# Altium schematic sheet HEXADECASPI_PSRAM.SchDoc: HEXADECASPI PSRAM
size A4; Date: Not used; ApprovedBy: Not used; CheckedBy: Not used; Author: Not used; CompanyName: STMicroelectronics; DrawnBy: Not used; Engineer: Not used; Organization: Not used; Address1: Not used; Address2: Not used; Address3: Not used; Address4: Not used; DocumentNumber: Not used; Revision: Not used; SheetNumber: 7; SheetTotal: 16; CurrentTime: Not used; CurrentDate: Not used; Time: Not used; DocumentFullPathAndName: Not used; DocumentName: Not used; ModifiedDate: Not used; ImagePath: Not used; ProjectName: Not used; Application_BuildNumber: Not used
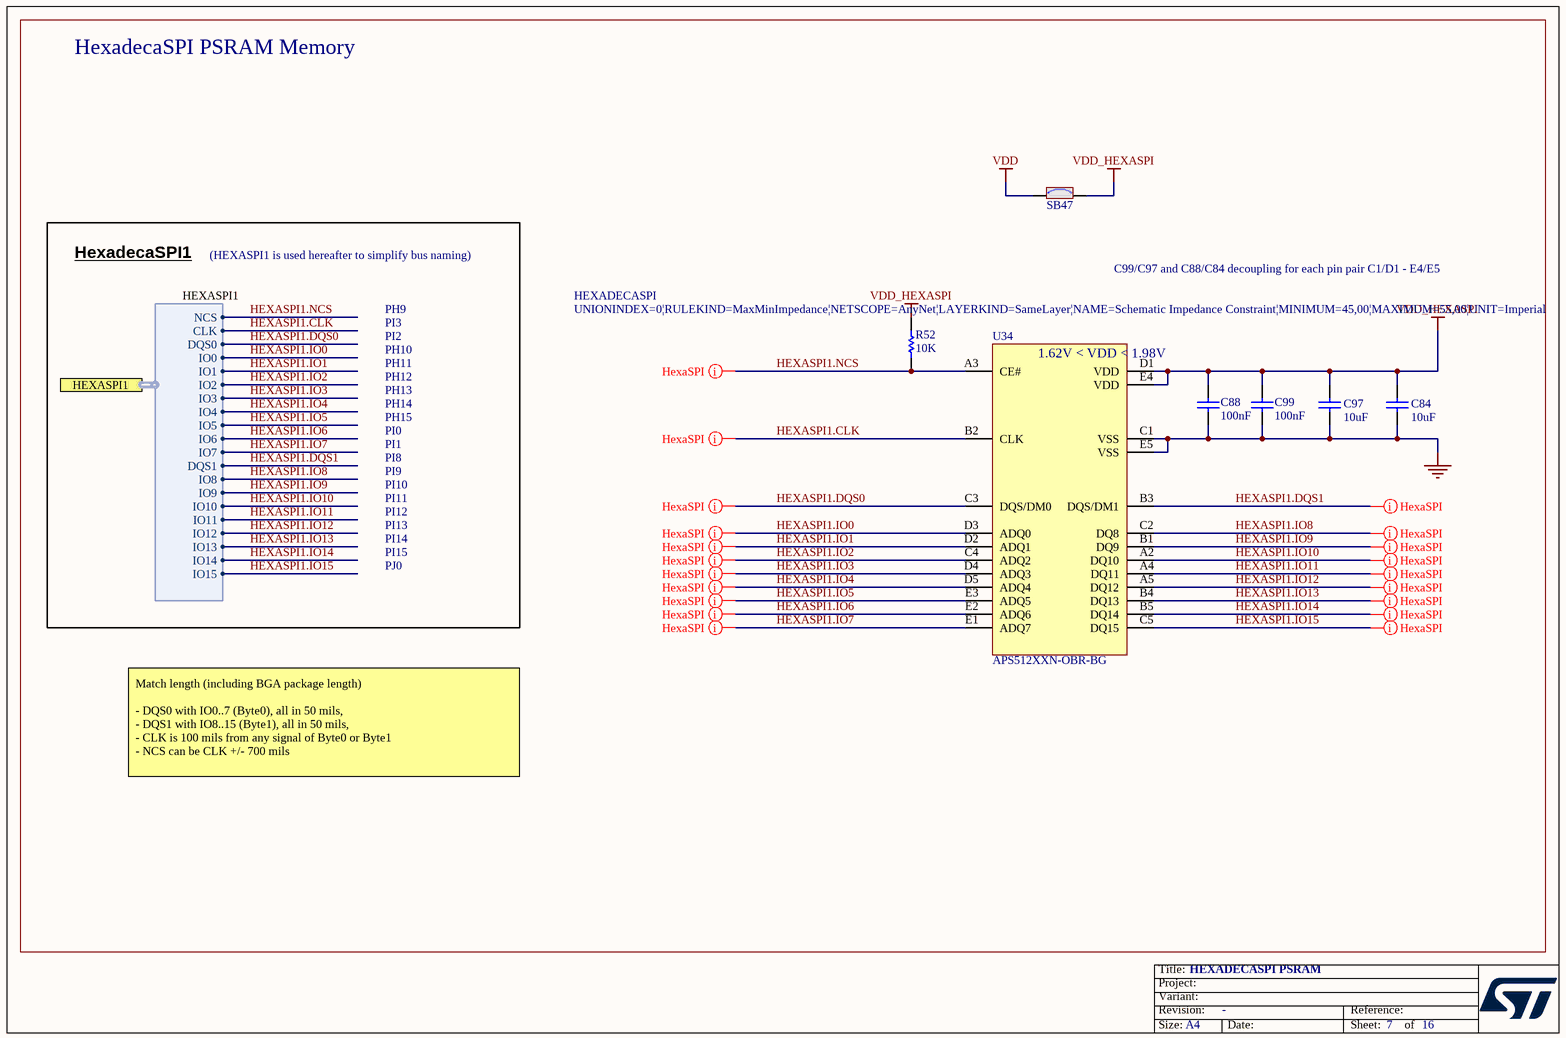
[diagram p0: HEXADECASPI_PSRAM.SchDoc]

## Parts
C84  value 10uF  [C0603_H0P8]  (hidden comment: Capacitor)
C88  value 100nF  [C0402]  (hidden comment: Capacitor)
C97  value 10uF  [C0603_H0P8]  (hidden comment: Capacitor)
C99  value 100nF  [C0402]  (hidden comment: Capacitor)
R52  value 10K  [R0402]  (hidden comment: Resistor)
SB47  SB_ON  [SOLDER-BRIDGE_R0402-0R]  (value not drawn)
U34  value APS512XXN-OBR-BG  [ICC_BGA24_5X5-BALL-ARRAY_6X8_P1]  (hidden comment: APS256XXN-OBR-BG)

## Ports
HEXASPI1 (harness HEXASPI1)

## Harnesses
HEXASPI1: IO1, IO0, DQS0, NCS, IO2, IO3, IO5, IO4, IO6, IO7, CLK, DQS1, IO8, IO9, IO10, IO11, IO12, IO13, IO14, IO15

## Nets
GND: C84.1 C88.1 C97.1 C99.1 U34.C1(VSS) U34.E5(VSS)
VDD: SB47.1
VDD_HEXASPI: C84.2 C88.2 C97.2 C99.2 R52.2 SB47.2 U34.D1(VDD) U34.E4(VDD)
HEXASPI1.CLK: U34.B2(CLK) ; port HEXASPI1.CLK
HEXASPI1.DQS0: U34.C3(DQS/DM0) ; port HEXASPI1.DQS0
HEXASPI1.DQS1: U34.B3(DQS/DM1) ; port HEXASPI1.DQS1
HEXASPI1.IO0: U34.D3(ADQ0) ; port HEXASPI1.IO0
HEXASPI1.IO1: U34.D2(ADQ1) ; port HEXASPI1.IO1
HEXASPI1.IO2: U34.C4(ADQ2) ; port HEXASPI1.IO2
HEXASPI1.IO3: U34.D4(ADQ3) ; port HEXASPI1.IO3
HEXASPI1.IO4: U34.D5(ADQ4) ; port HEXASPI1.IO4
HEXASPI1.IO5: U34.E3(ADQ5) ; port HEXASPI1.IO5
HEXASPI1.IO6: U34.E2(ADQ6) ; port HEXASPI1.IO6
HEXASPI1.IO7: U34.E1(ADQ7) ; port HEXASPI1.IO7
HEXASPI1.IO8: U34.C2(DQ8) ; port HEXASPI1.IO8
HEXASPI1.IO9: U34.B1(DQ9) ; port HEXASPI1.IO9
HEXASPI1.IO10: U34.A2(DQ10) ; port HEXASPI1.IO10
HEXASPI1.IO11: U34.A4(DQ11) ; port HEXASPI1.IO11
HEXASPI1.IO12: U34.A5(DQ12) ; port HEXASPI1.IO12
HEXASPI1.IO13: U34.B4(DQ13) ; port HEXASPI1.IO13
HEXASPI1.IO14: U34.B5(DQ14) ; port HEXASPI1.IO14
HEXASPI1.IO15: U34.C5(DQ15) ; port HEXASPI1.IO15
HEXASPI1.NCS: R52.1 U34.A3(CE#) ; port HEXASPI1.NCS

## Layout directives
rule Matched Net Lengths [Tolerance = 1000mil]; net class HEXASPI; rule Impedance Constraint [Min = 50.00    Max = 60.00    ]; rule Routing Layers [TopLayer - Enabled BottomLayer - Enabled ]: HEXASPI1.NCS
rule Matched Net Lengths [Tolerance = 20mil]; net class HEXASPI; rule Impedance Constraint [Min = 45.00    Max = 55.00    ]; rule Routing Layers [TopLayer - Enabled BottomLayer - Enabled ]: HEXASPI1.DQS1, HEXASPI1.IO0, HEXASPI1.IO1, HEXASPI1.IO2, HEXASPI1.IO3, HEXASPI1.IO4, HEXASPI1.IO5, HEXASPI1.IO6, HEXASPI1.IO7, HEXASPI1.IO8, HEXASPI1.IO9, HEXASPI1.IO10, HEXASPI1.IO11, HEXASPI1.IO12, HEXASPI1.IO13, HEXASPI1.IO14, HEXASPI1.IO15
rule Matched Net Lengths [Tolerance = 20mil]; net class HEXADECASPI; rule Impedance Constraint [Min = 45.00    Max = 55.00    ]; rule Routing Layers [TopLayer - Enabled BottomLayer - Enabled ]: HEXASPI1.CLK
rule Matched Net Lengths [Tolerance = 20mil]; net class HEXASPI; rule Impedance Constraint [Min = 50.00    Max = 60.00    ]; rule Routing Layers [TopLayer - Enabled BottomLayer - Enabled ]: HEXASPI1.DQS0

## Notes on the sheet
- HexadecaSPI PSRAM Memory
- HexadecaSPI1
- (HEXASPI1 is used hereafter to simplify bus naming)
- PH9
- C99/C97 and C88/C84 decoupling for each pin pair C1/D1 - E4/E5
- PH10
- PH11
- PH12
- PI2
- PI3
- 1.62V < VDD < 1.98V
- PH13
- PH14
- PH15
- PI0
- PI1
- PI8
- PI9
- PI10
- PI11
- PI12
- PI13
- PI14
- PI15
- PJ0
- Match length (including BGA package length)
  - DQS0 with IO0..7 (Byte0), all in 50 mils,
  - DQS1 with IO8..15 (Byte1), all in 50 mils,
  - CLK is 100 mils from any signal of Byte0 or Byte1
  - NCS can be CLK +/- 700 mils
- Title:
- Project:
- Size:
- Revision:
- Variant:
- A4
- -
- Date:
- Reference:
- Sheet:
- of

## Library data of the parts
C84 C97 = MCD-02605: Capacitor, MLCC, 10uF, 10V, X5R, +/-10%, 0603, T=0.8mm; Manufacturer_Part_Number: CC0603KRX5R6BB106; Manufacturer: YAGEO; Part_Preference: Recommended; Order_Code_RS: 2006536; ShowFields: YES; ID: 4711; Internal_Part_Number: MCD-02605; Status: Checked; Part_Type: Capacitor; Package: 0603; ComponentLink1URL: http://tunmcdsvn.tun.st.com/Component_Documentation_Library/Trunk/Capacitor/YAGEO_X5R_Series; Order_Code_Digikey: 311-1782-2-ND; Order_Code_Farnell: 3759761
C88 C99 = MCD-00006: Capacitor, MLCC, 100nF, 16V, X7R, +/-10%, 0402, T=0.5mm; Manufacturer_Part_Number: CC0402KRX7R7BB104; Manufacturer: YAGEO; Part_Preference: Recommended; Order_Code_RS: 616-9701; Component_Country_Of_Origin: China; Internal_Part_Number: MCD-00006; Status: Released; Part_Type: Capacitor; Package: 0402; ComponentLink1URL: http://tunmcdsvn.tun.st.com/Component_Documentation_Library/Trunk/Capacitor/YAGEO_X7R_Series; Order_Code_Digikey: 311-1338-1-ND; Order_Code_Farnell: 9402047
R52 = MCD-00053: Resistor, 10K, 0402, +/-1%, 1/16W; Manufacturer_Part_Number: RC0402FR-0710KL; Manufacturer: YAGEO; BMS_Part_Number: 9131590; Part_Preference: Recommended; Component_Country_Of_Origin: China; Internal_Part_Number: MCD-00053; Status: Released; Part_Type: Resistor; ComponentLink1URL: http://tunmcdsvn.tun.st.com/Component_Documentation_Library/Trunk/Resistor/YAGEO_RC_L_Series; Package: 0402; Order_Code_Digikey: 311-10.0KLRCT-ND; Order_Code_Farnell: 9239359; Order_Code_RS: N/A
SB47 = MCD-01618: Solder Bridge 0402 ON; Part_Type: Misc; Manufacturer_Part_Number: RC0402JR-070RL; Manufacturer: YAGEO; Part_Preference: Recommended; Order_Code_RS: 618-5804; Component_Country_Of_Origin: China; Internal_Part_Number: MCD-01618; Status: Released; Package: SB0402; ComponentLink1URL: http://tunmcdsvn.tun.st.com/Component_Datasheet_Library/Trunk/Resistors/Yageo_Resistor_RC0402-series; Order_Code_Digikey: 311-0.0JRTR-ND; Order_Code_Farnell: 2363467
U34 = MCD-02904: Memory,Hexa-SPI-PSRAM,512Mb,x8x16,200MHz,1.8V,DDR,BGA24, PASR LVCMOS; Part_Type: IC; Manufacturer: AP MEMORY TECHNOLOGY CORP.; Part_Preference: Recommended; ShowFields: YES; ID: 5020; Internal_Part_Number: MCD-02904; Status: New; Manufacturer_Part_Number: APS512XXN-OBR-BG; Package: BGA24; ComponentLink1URL: http://tunmcdsvn.tun.st.com/Component_Documentation_Library/Trunk/IC/AP_MEMORY_TECHNOLOGY_CORP_APS512XXN-OBR-BG; Order_Code_Digikey: N/A; Order_Code_Farnell: N/A; Order_Code_RS: N/A